# EAGLE design BATT_CONNECTOR (EAGLE 9.6.2)
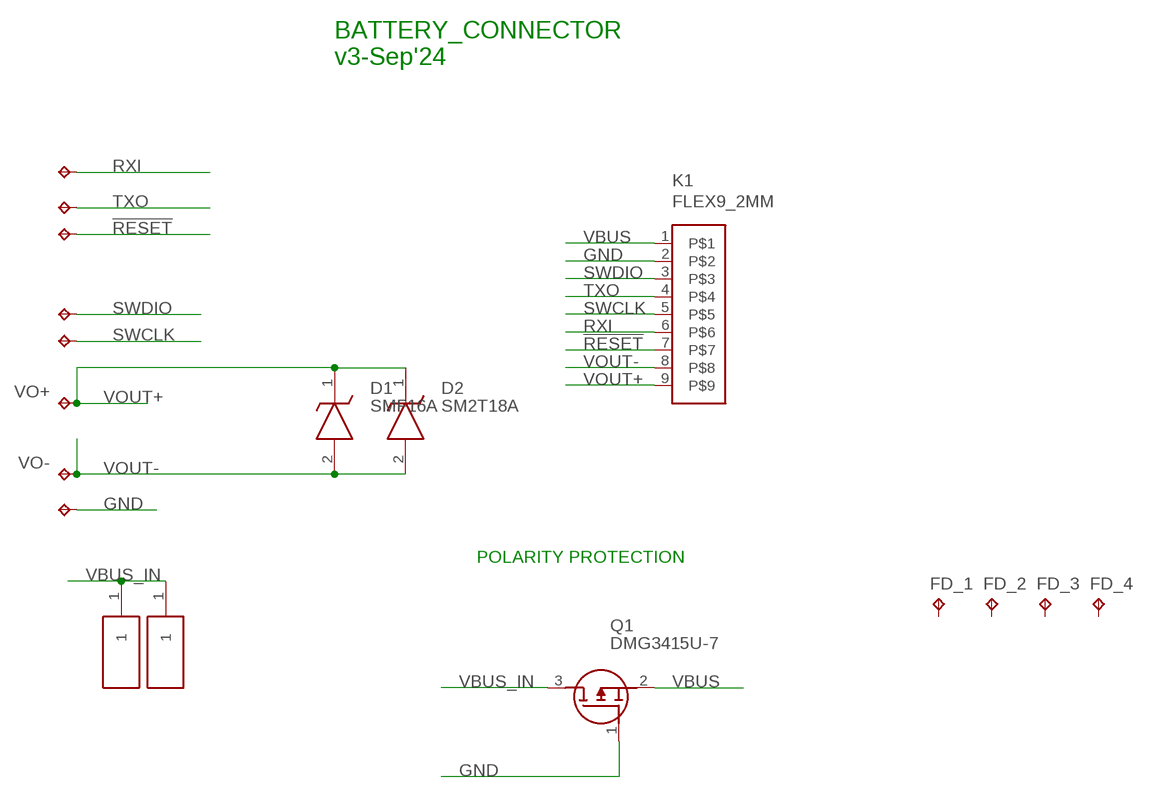
[diagram p0: schematic, sheet 1]

## Parts
!RESET  TPB2,54  [B2,54]
D1  SMF16A  [SODFL3618X110N]
D2  SM2T18A  [SM2T18A]
FD_1  FD_1  TPTP06SQ  [TP06SQ]
FD_2  FD_1  TPTP06SQ  [TP06SQ]
FD_3  FD_1  TPTP06SQ  [TP06SQ]
FD_4  FD_1  TPTP06SQ  [TP06SQ]
GND  TPB2,54  [B2,54]
H1  S1761-42R  [S176142R]
H2  S1761-42R  [S176142R]
K1  FLEX9_2MM  [FLEX9_2MM]
Q1  DMG3415U-7  SSM3J338R,LF  [SSM3J332RLFT]
RXI  TPB2,54  [B2,54]
SWCLK  TPB2,54  [B2,54]
SWDIO  TPB2,54  [B2,54]
TXO  TPB2,54  [B2,54]
VO+  TPB2,54  [B2,54]
VO-  TPB2,54  [B2,54]

## Nets
!RESET: !RESET.TP K1.7
GND: GND.TP K1.2 Q1.1(G)
RXI: K1.6 RXI.TP
SWCLK: K1.5 SWCLK.TP
SWDIO: K1.3 SWDIO.TP
TXO: K1.4 TXO.TP
VBUS: K1.1 Q1.2(S)
VBUS_IN: H1.1 H2.1 Q1.3(D)
VOUT+: D1.1(K) D2.1(K) K1.9 VO+.TP
VOUT-: D1.2(A) D2.2(A) K1.8 VO-.TP
Unconnected: FD_1.TP FD_2.TP FD_3.TP FD_4.TP

## Notes on the sheet
- BATTERY_CONNECTOR
  v3-Sep'24
- POLARITY PROTECTION

## Library data of the parts
!RESET FD_1-FD_4 GND RXI SWCLK SWDIO TXO VO+ VO- = testpad:TP: Test pad
D1 = SMF16A:SMF16A: ESD Suppressors / TVS Diodes 200W 16V 5% Uni-directional Source: Datasheet <https://www.littelfuse.com/~/media/electronics/datasheets/tvs_diodes/littelfuse_tvs_diode_smf_datasheet.pdf.pdf>; ARROW_PART_NUMBER: SMF16A; ARROW_PRICE-STOCK: https://www.arrow.com/en/products/smf16a/littelfuse; DESCRIPTION: ESD Suppressors / TVS Diodes 200W 16V 5% Uni-directional; HEIGHT: 1.1mm; MANUFACTURER_NAME: LITTELFUSE; MANUFACTURER_PART_NUMBER: SMF16A; MOUSER_PART_NUMBER: 576-SMF16A; MOUSER_PRICE-STOCK: https://www.mouser.co.uk/ProductDetail/Littelfuse/SMF16A?qs=IP%252BaFeBnnar8T%2Ffm%252BJ%2Flrw%3D%3D
D2 = SM2T18A:SM2T18A: 200 W TVS in STmite Source: Datasheet <https://www.st.com/resource/en/datasheet/sm2t.pdf>; DESCRIPTION: 200 W TVS in STmite; HEIGHT: 1.15mm; MANUFACTURER_NAME: STMicroelectronics; MANUFACTURER_PART_NUMBER: SM2T18A; MOUSER_PART_NUMBER: 511-SM2T18A; MOUSER_PRICE-STOCK: https://www.mouser.co.uk/ProductDetail/STMicroelectronics/SM2T18A?qs=9NrABl3fj%2FoQ9e7jVf8sKA%3D%3D
H1 H2 = S1761-42R:S1761-42R: EZ_Boardware SMT Spring Contact 3.5mm Source: Datasheet <https://cdn.harwin.com/pdfs/S1761-XXR.pdf>; DESCRIPTION: EZ_Boardware SMT Spring Contact 3.5mm; HEIGHT: 3.8mm; MANUFACTURER_NAME: Harwin; MANUFACTURER_PART_NUMBER: S1761-42R; MOUSER_PART_NUMBER: 855-S1761-42R; MOUSER_PRICE-STOCK: https://www.mouser.co.uk/ProductDetail/Harwin/S1761-42R?qs=ulE8k0yEMYZkmoaxRCFkSQ%3D%3D
K1 = Flex_3mm:FLEX9_2MM
Q1 = SSM3J338R_LF:SSM3J338R,LF: MOSFET Small-signal MOSFET Vdss= -12V, ID= -6A Source: Datasheet <http://toshiba.semicon-storage.com/info/docget.jsp?did=30384&prodName=SSM3J338R>; ARROW_PART_NUMBER: SSM3J338R,LF; ARROW_PRICE-STOCK: https://www.arrow.com/en/products/ssm3j338rlf/toshiba?region=nac; DESCRIPTION: MOSFET Small-signal MOSFET Vdss= -12V, ID= -6A; HEIGHT: mm; MANUFACTURER_NAME: Toshiba; MANUFACTURER_PART_NUMBER: SSM3J338R,LF; MOUSER_PART_NUMBER: 757-SSM3J338RLF; MOUSER_PRICE-STOCK: https://www.mouser.co.uk/ProductDetail/Toshiba/SSM3J338RLF?qs=lhkzy8lC%252BSvURFM9ZjmJSw%3D%3D

## Board
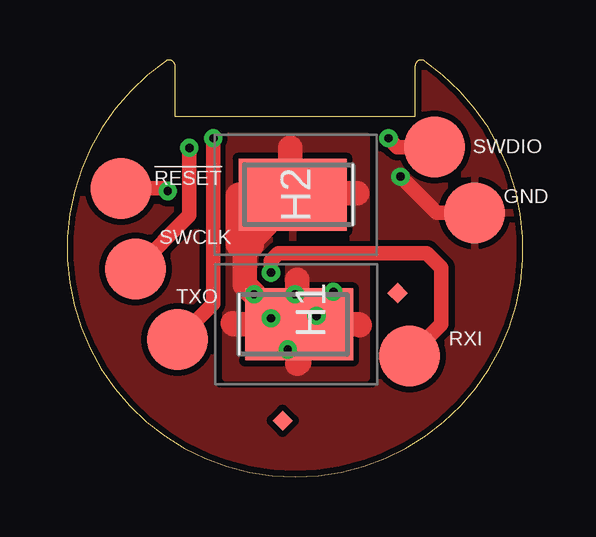
[diagram p1: board, top side]
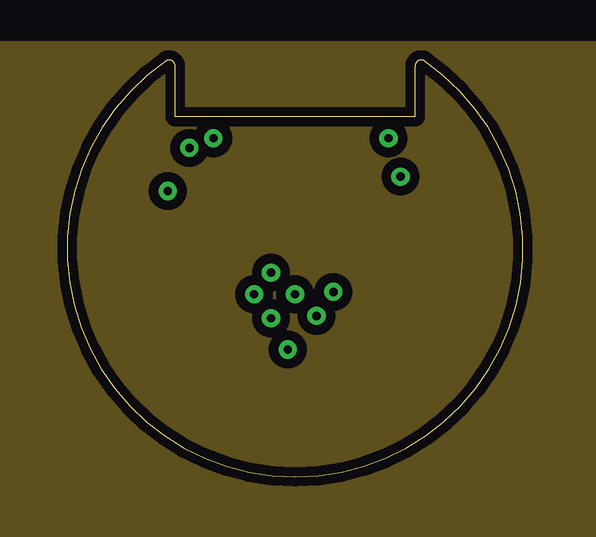
[diagram p2: board, inner layer Route2]
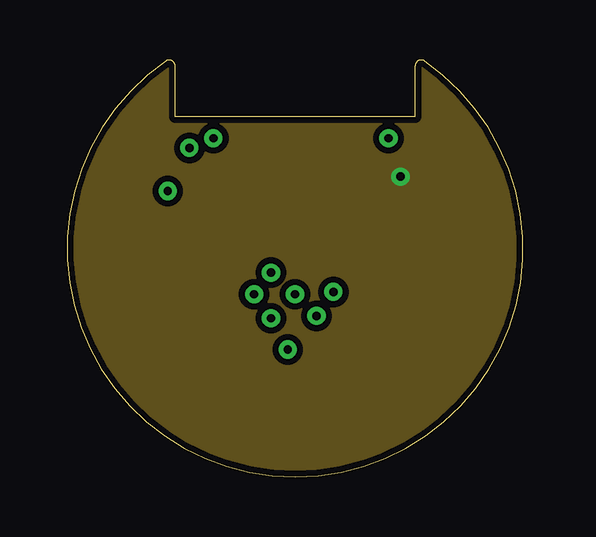
[diagram p3: board, inner layer Route15]
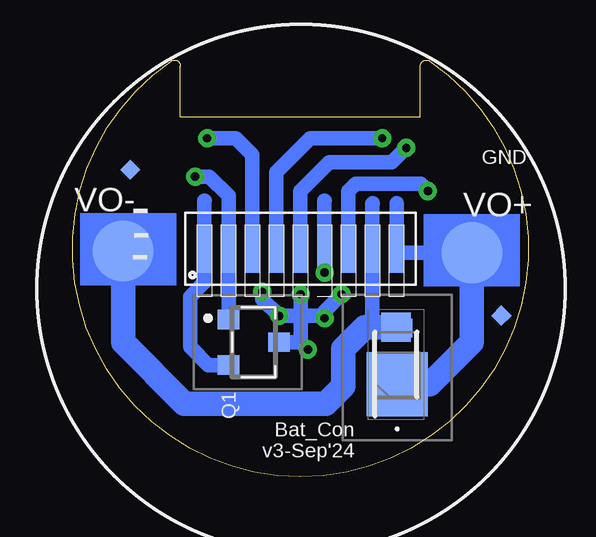
[diagram p4: board, bottom side, seen from below]

Size 18.98 x 17.37 mm. Coordinates in mm from the lower left corner, seen from the top.
Outline: 14.88,17.32 arc125 14.49,17.12 14.49,15 4.49,15 4.49,17.12 arc125 4.1,17.32 arc291 14.88,17.32
Copper layers (1+2*15+16): Top 0.035mm / dielectric 1.5mm / Route2 0.035mm / dielectric 0.15mm / Route15 0.035mm / dielectric 0.2mm / Bottom 0.035mm
Design rules "default *": minimum track width 0.00038125mm, minimum drill 0.35mm, track to track 8mil, track to pad 8mil, pad to pad 8mil, via to via 8mil, smd to smd 5mil, copper to edge 8mil, drill to drill 8mil, minimum pad ring 10mil, minimum via ring 8mil, stop-mask expansion 2mil, vias tented up to drill 50mil, thermal gap 10mil

### Footprints (pad centres in the part's own frame; a part is rotated, then mirrored left to right if it is on the bottom)
B2,54 = smd 2.54 x 2.54: TP 0,0
SODFL3618X110N = smd 1.2 x 1.22: 1 -1.55,0; 2 1.55,0
SM2T18A = smd 2.67 x 2.54: 1 -0.698,0 | smd 0.762 x 1.27: 2 1.653,0
TP06SQ = smd 0.6 x 0.6: TP 0,0
S176142R = smd 3 x 4.5: 1 0,-2
FLEX9_2MM = smd 0.6 x 2: 1 0.8,1.5; 2 1.8,1.5; 3 2.8,1.5; 4 3.8,1.5; 5 4.8,1.5; 6 5.8,1.5; 7 6.8,1.5; 8 7.8,1.5; 9 8.8,1.5
SSM3J332RLFT = smd 0.8 x 0.9: 1 -0.95,-1.05; 2 0.95,-1.05; 3 0,1.05

### Placement (x,y rotation side)
!RESET  2.23,12.02 0 top
D1  5.51,4.68 90 bottom
D2  5.46,4.55 90 bottom
FD_1  1.12,6.72 45 bottom
FD_2  16.58,12.8 45 bottom
FD_3  8.97,2.34 45 top
FD_4  13.76,7.66 45 top
GND  16.97,11 0 top
H1  11.65,6.35 270 top
H2  7.38,11.76 90 top
K1  14.29,8.01 0 bottom
Q1  11.44,5.61 270 bottom
RXI  14.26,5.03 0 top
SWCLK  2.84,8.66 0 top
SWDIO  15.29,13.74 0 top
TXO  4.59,5.72 0 top
VO+  2.35,9.34 0 bottom
VO-  16.88,9.42 0 bottom

### Tracks (layer width: path | path; a pad name or v marks a point on that pad's centre or on a via)
!RESET  (via drill 0.35)
  Top 0.305: !RESET.TP 2.29,12.02
  Top 0.61: 2.29,12.02 4.07,12.02 v4.18,11.91
  Bottom 0.61: v4.18,11.91 4.48,12.21 7.18,12.21 7.49,11.9 K1.7
GND  (via drill 0.35)
  Top 0.61: GND.TP 15.39,11 v13.88,12.51
  Bottom 0.61: v13.88,12.51 13.28,12.51 12.48,11.71 K1.2 | K1.2 | Q1.1 K1.2
  pour Top (isolate 0.254, rank 2): -1.53,18.46 21.96,18.46 21.96,-0.67 -1.53,-0.67
  pour Route15 (isolate 0.254, rank 2): -2.9,18.25 -2.9,-3.35 23.58,-3.35 23.58,18.25
RXI  (via drill 0.35)
  Top 0.61: v8.48,8.51 8.48,9.01 8.78,9.31 14.98,9.31 15.58,8.71 15.58,6.35 RXI.TP
  Bottom 0.61: v8.48,8.51 v8.49,8.52 K1.6 8.49,11.5 8.48,11.51
SWCLK  (via drill 0.35)
  Top 0.61: SWCLK.TP 5.08,10.9 v5.08,13.71
  Bottom 0.61: v5.08,13.71 5.68,13.11 8.28,13.11 9.49,11.9 K1.5
SWDIO  (via drill 0.35)
  Top 0.61: SWDIO.TP 13.75,13.74 v13.38,14.11
  Bottom 0.61: v13.38,14.11 12.18,14.11 11.49,13.42 K1.3
TXO  (via drill 0.35)
  Top 0.305: TXO.TP 5.2,6.4
  Top 0.61: TXO.TP 6.08,7.21 v6.08,14.11
  Bottom 0.61: K1.4 10.49,12.7 9.08,14.11 v6.08,14.11
VBUS
  Bottom 0.61: Q1.2 13.33,4.66 14.09,5.42 14.09,7.51 13.49,8.11 K1.1 13.49,11.5 13.48,11.51
  pour Route2 (isolate 0.406, rank 2): -2.92,18.11 -2.92,-3.19 23.59,-3.19 23.59,18.11
VBUS_IN  (via drill 0.35)
  Top 0.61: v9.18,5.31 9.18,5.88 H1.1
  Top 1.016: H1.1 6.94,6.35 6.88,6.41 | H1.1 9.65,4.78 9.58,4.71 | H1.1 9.57,6.43 9.57,8.21 | H1.1 12.14,6.35 12.18,6.31 | H2.1 7.15,11.76 7.1,11.71 7.1,9.69 7.28,9.51 8.28,10.51 7.68,11.11 7.68,9.64 7.39,9.35 7.39,7.99 v7.78,7.61 | H2.1 9.28,11.86 9.28,13.71 | H2.1 9.43,11.81 12.08,11.81
  Bottom 0.61: Q1.3 9.48,5.61 | 9.48,5.61 v9.18,5.31 | v7.78,7.61 8.48,6.91 v8.48,6.61 8.58,6.71 9.48,6.71 | 9.48,6.71 v10.38,6.71 11.08,7.41 v11.08,7.71 | v9.48,7.61 9.48,6.71 | 9.48,6.71 9.48,5.61
  pour Top: 6.59,14.2 12.45,14.2 12.45,4.12 6.59,4.12
VOUT+
  Bottom 0.61: 2.35,9.36 VO+.TP 5.32,9.34 K1.9 5.48,11.39 | D2.1 4.98,3.85 4.98,3.66 D1.1
  Bottom 1.016: 4.98,3.85 4.1,3.85 2.35,5.6 VO+.TP
VOUT-
  Bottom 0.61: D2.2 5.49,6.23 D1.2 6.48,6.23 6.49,6.24 K1.8 6.49,11.38 6.48,11.39
  Bottom 1.016: VO-.TP 16.88,5.6 14.32,3.05 8.44,3.05 7.71,3.78 7.71,5.33 6.81,6.23 D1.2
(copper drawn outside any net)
  shapes: Bottom area x2

### Text on the board
bPlace: Bat_Con / v3-Sep'24
bNames: GND | - | - | -